# Altium schematic sheet Block Diagram.SchDoc: B100AA Development Kit Block Diagram
size A3
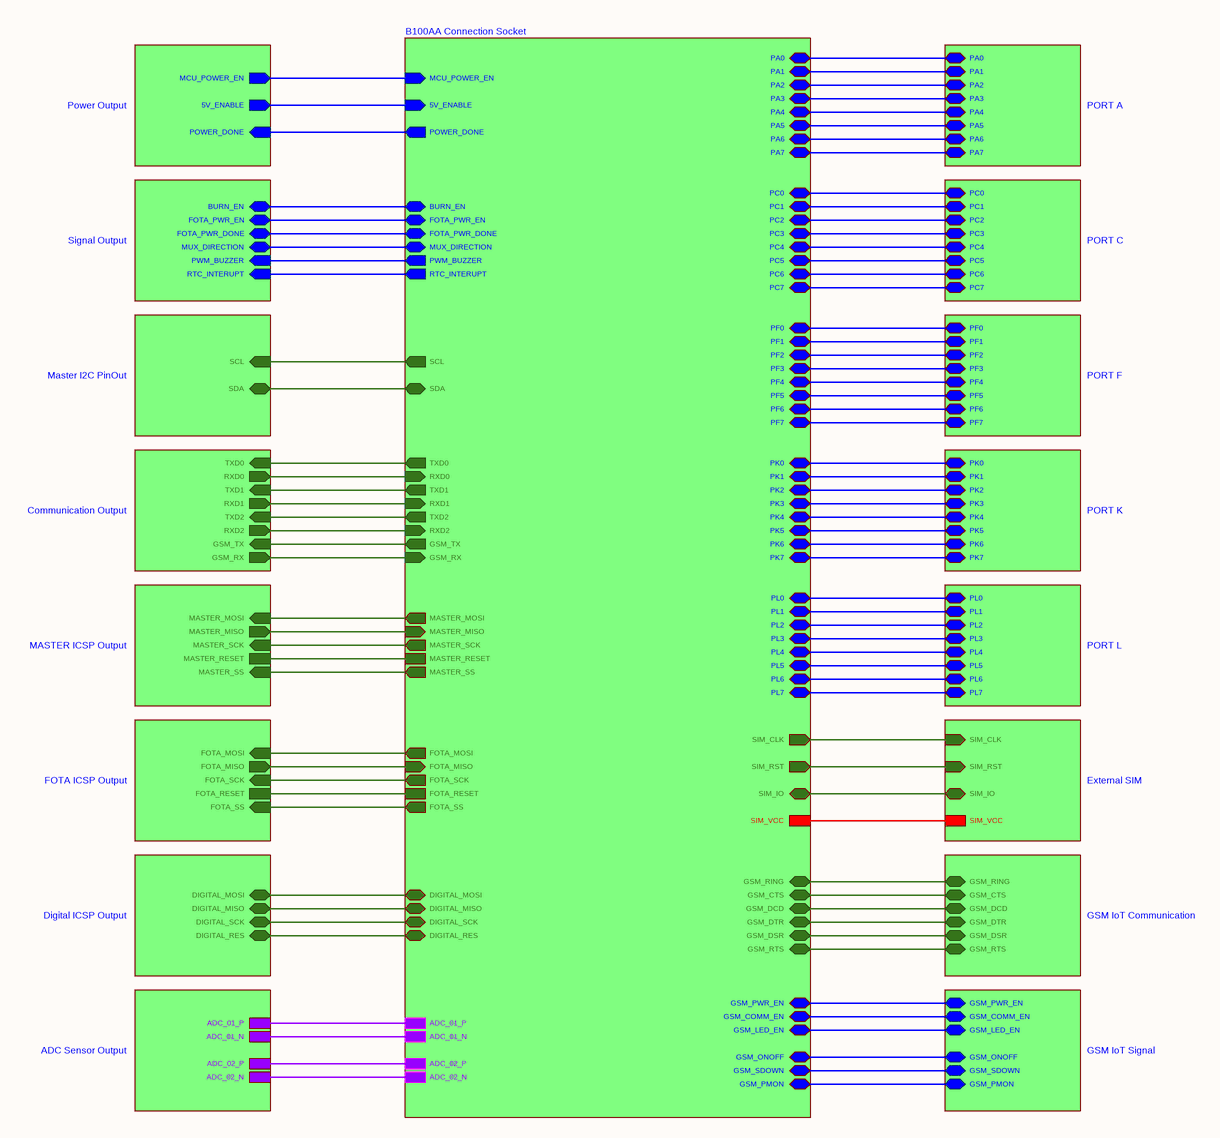
[diagram p0: Block Diagram.SchDoc]

## Sub-sheets
ADC Sensor Output = ADS Sensor Sockets.SchDoc: ADC_01_N, ADC_02_N, ADC_02_P, ADC_01_P
B100AA Connection Socket = Connection Socket.SchDoc: GSM_COMM_EN (bidir), PC6 (bidir), PF1 (bidir), PF3 (bidir), GSM_CTS (bidir), PF0 (bidir), GSM_TX (out), GSM_RX (in), PA6 (bidir), GSM_PMON (bidir), PK5 (bidir), PF2 (bidir), GSM_RING (bidir), ADC_01_P, PA5 (bidir), PL1 (bidir), PL2 (bidir), GSM_DCD (bidir), GSM_DTR (bidir), BURN_EN (bidir), PA4 (bidir), PA3 (bidir), PK0 (bidir), PC4 (bidir), GSM_DSR (bidir), ADC_02_P, GSM_LED_EN (bidir), ADC_02_N, PF7 (bidir), TXD1 (out), PK2 (bidir), SIM_CLK (out), DIGITAL_SCK (bidir), GSM_RTS (bidir), SIM_RST (out), PL4 (bidir), GSM_PWR_EN (bidir), GSM_ONOFF (bidir), PA1 (bidir), PK1 (bidir), PK4 (bidir), PF6 (bidir), PL5 (bidir), PF5 (bidir), SIM_IO (bidir), PK6 (bidir), FOTA_MISO (in), PK7 (bidir), SCL (out), ADC_01_N, SDA (bidir), PC3 (bidir), PC1 (bidir), PL7 (bidir), PC2 (bidir), PL6 (bidir), PK3 (bidir), DIGITAL_MOSI (bidir), PA2 (bidir), FOTA_PWR_DONE (bidir), FOTA_PWR_EN (bidir), PL3 (bidir), RXD2 (in), PWM_BUZZER (out), MUX_DIRECTION (bidir), SIM_VCC, 5V_ENABLE (in), PC7 (bidir), GSM_SDOWN (bidir), PA0 (bidir), RTC_INTERUPT (out), DIGITAL_MISO (bidir), PA7 (bidir), RXD1 (in), TXD2 (out), RXD0 (in), TXD0 (out), PC0 (bidir), PF4 (bidir), DIGITAL_RES (bidir), PL0 (bidir), MCU_POWER_EN (in), FOTA_MOSI (out), PC5 (bidir), POWER_DONE (out), FOTA_SS (out), FOTA_SCK (out), FOTA_RESET, MASTER_MISO (in), MASTER_RESET, MASTER_MOSI (out), MASTER_SCK (out), MASTER_SS (out)
Communication Output = UART Communication.SchDoc: TXD2 (in), RXD1 (out), RXD2 (out), GSM_RX (out), GSM_TX (in), TXD0 (in), TXD1 (in), RXD0 (out)
Digital ICSP Output = Digital ICSP Test Points.SchDoc: DIGITAL_SCK (bidir), DIGITAL_MISO (bidir), DIGITAL_RES (bidir), DIGITAL_MOSI (bidir)
External SIM = External SIM Tray.SchDoc: SIM_IO (bidir), SIM_VCC, SIM_CLK (in), SIM_RST (in)
FOTA ICSP Output = FOTA MCU ICSP Communication.SchDoc: FOTA_MISO (out), FOTA_MOSI (in), FOTA_RESET, FOTA_SCK (in), FOTA_SS (in)
GSM IoT Communication = GSM Communication Signals.SchDoc: GSM_DSR (bidir), GSM_RING (bidir), GSM_DCD (bidir), GSM_DTR (bidir), GSM_CTS (bidir), GSM_RTS (bidir)
GSM IoT Signal = GSM Control Signals.SchDoc: GSM_COMM_EN (bidir), GSM_LED_EN (bidir), GSM_SDOWN (bidir), GSM_PMON (bidir), GSM_ONOFF (bidir), GSM_PWR_EN (bidir)
Master I2C PinOut = I2C PinOut.SchDoc: SCL (in), SDA (bidir)
MASTER ICSP Output = Master MCU ICSP Communication.SchDoc: MASTER_MISO (out), MASTER_SCK (in), MASTER_MOSI (in), MASTER_SS (in), MASTER_RESET
PORT A = Digital Port A.SchDoc: PA7 (bidir), PA2 (bidir), PA5 (bidir), PA6 (bidir), PA1 (bidir), PA3 (bidir), PA4 (bidir), PA0 (bidir)
PORT C = Digital Port C.SchDoc: PC7 (bidir), PC2 (bidir), PC5 (bidir), PC6 (bidir), PC1 (bidir), PC3 (bidir), PC4 (bidir), PC0 (bidir)
PORT F = Digital Port F.SchDoc: PF7 (bidir), PF2 (bidir), PF5 (bidir), PF6 (bidir), PF1 (bidir), PF3 (bidir), PF4 (bidir), PF0 (bidir)
PORT K = Digital Port K.SchDoc: PK7 (bidir), PK2 (bidir), PK5 (bidir), PK6 (bidir), PK1 (bidir), PK3 (bidir), PK4 (bidir), PK0 (bidir)
PORT L = Digital Port L.SchDoc: PL7 (bidir), PL2 (bidir), PL5 (bidir), PL6 (bidir), PL1 (bidir), PL3 (bidir), PL4 (bidir), PL0 (bidir)
Power Output = Power Network.SchDoc: MCU_POWER_EN (out), POWER_DONE (in), 5V_ENABLE (out)
Signal Output = Signal Outputs.SchDoc: FOTA_PWR_DONE (bidir), MUX_DIRECTION (bidir), FOTA_PWR_EN (bidir), RTC_INTERUPT (in), BURN_EN (bidir), PWM_BUZZER (in)

## Nets
(unnamed): sheet B100AA Connection Socket/GSM_COMM_EN, sheet GSM IoT Signal/GSM_COMM_EN
(unnamed): sheet B100AA Connection Socket/PC6, sheet PORT C/PC6
(unnamed): sheet B100AA Connection Socket/PF1, sheet PORT F/PF1
(unnamed): sheet B100AA Connection Socket/PF3, sheet PORT F/PF3
(unnamed): sheet B100AA Connection Socket/GSM_CTS, sheet GSM IoT Communication/GSM_CTS
(unnamed): sheet B100AA Connection Socket/PF0, sheet PORT F/PF0
(unnamed): sheet B100AA Connection Socket/GSM_TX, sheet Communication Output/GSM_TX
(unnamed): sheet B100AA Connection Socket/GSM_RX, sheet Communication Output/GSM_RX
(unnamed): sheet B100AA Connection Socket/PA6, sheet PORT A/PA6
(unnamed): sheet B100AA Connection Socket/GSM_PMON, sheet GSM IoT Signal/GSM_PMON
(unnamed): sheet B100AA Connection Socket/PK5, sheet PORT K/PK5
(unnamed): sheet B100AA Connection Socket/PF2, sheet PORT F/PF2
(unnamed): sheet B100AA Connection Socket/GSM_RING, sheet GSM IoT Communication/GSM_RING
(unnamed): sheet B100AA Connection Socket/ADC_01_P, sheet ADC Sensor Output/ADC_01_P
(unnamed): sheet B100AA Connection Socket/PA5, sheet PORT A/PA5
(unnamed): sheet B100AA Connection Socket/PL1, sheet PORT L/PL1
(unnamed): sheet B100AA Connection Socket/PL2, sheet PORT L/PL2
(unnamed): sheet B100AA Connection Socket/GSM_DCD, sheet GSM IoT Communication/GSM_DCD
(unnamed): sheet B100AA Connection Socket/GSM_DTR, sheet GSM IoT Communication/GSM_DTR
(unnamed): sheet B100AA Connection Socket/BURN_EN, sheet Signal Output/BURN_EN
(unnamed): sheet B100AA Connection Socket/PA4, sheet PORT A/PA4
(unnamed): sheet B100AA Connection Socket/PA3, sheet PORT A/PA3
(unnamed): sheet B100AA Connection Socket/PK0, sheet PORT K/PK0
(unnamed): sheet B100AA Connection Socket/PC4, sheet PORT C/PC4
(unnamed): sheet B100AA Connection Socket/GSM_DSR, sheet GSM IoT Communication/GSM_DSR
(unnamed): sheet B100AA Connection Socket/ADC_02_P, sheet ADC Sensor Output/ADC_02_P
(unnamed): sheet B100AA Connection Socket/GSM_LED_EN, sheet GSM IoT Signal/GSM_LED_EN
(unnamed): sheet B100AA Connection Socket/ADC_02_N, sheet ADC Sensor Output/ADC_02_N
(unnamed): sheet B100AA Connection Socket/PF7, sheet PORT F/PF7
(unnamed): sheet B100AA Connection Socket/TXD1, sheet Communication Output/TXD1
(unnamed): sheet B100AA Connection Socket/PK2, sheet PORT K/PK2
(unnamed): sheet B100AA Connection Socket/SIM_CLK, sheet External SIM/SIM_CLK
(unnamed): sheet B100AA Connection Socket/DIGITAL_SCK, sheet Digital ICSP Output/DIGITAL_SCK
(unnamed): sheet B100AA Connection Socket/GSM_RTS, sheet GSM IoT Communication/GSM_RTS
(unnamed): sheet B100AA Connection Socket/SIM_RST, sheet External SIM/SIM_RST
(unnamed): sheet B100AA Connection Socket/PL4, sheet PORT L/PL4
(unnamed): sheet B100AA Connection Socket/GSM_PWR_EN, sheet GSM IoT Signal/GSM_PWR_EN
(unnamed): sheet B100AA Connection Socket/GSM_ONOFF, sheet GSM IoT Signal/GSM_ONOFF
(unnamed): sheet B100AA Connection Socket/PA1, sheet PORT A/PA1
(unnamed): sheet B100AA Connection Socket/PK1, sheet PORT K/PK1
(unnamed): sheet B100AA Connection Socket/PK4, sheet PORT K/PK4
(unnamed): sheet B100AA Connection Socket/PF6, sheet PORT F/PF6
(unnamed): sheet B100AA Connection Socket/PL5, sheet PORT L/PL5
(unnamed): sheet B100AA Connection Socket/PF5, sheet PORT F/PF5
(unnamed): sheet B100AA Connection Socket/SIM_IO, sheet External SIM/SIM_IO
(unnamed): sheet B100AA Connection Socket/PK6, sheet PORT K/PK6
(unnamed): sheet B100AA Connection Socket/FOTA_MISO, sheet FOTA ICSP Output/FOTA_MISO
(unnamed): sheet B100AA Connection Socket/PK7, sheet PORT K/PK7
(unnamed): sheet B100AA Connection Socket/SCL, sheet Master I2C PinOut/SCL
(unnamed): sheet B100AA Connection Socket/ADC_01_N, sheet ADC Sensor Output/ADC_01_N
(unnamed): sheet B100AA Connection Socket/SDA, sheet Master I2C PinOut/SDA
(unnamed): sheet B100AA Connection Socket/PC3, sheet PORT C/PC3
(unnamed): sheet B100AA Connection Socket/PC1, sheet PORT C/PC1
(unnamed): sheet B100AA Connection Socket/PL7, sheet PORT L/PL7
(unnamed): sheet B100AA Connection Socket/PC2, sheet PORT C/PC2
(unnamed): sheet B100AA Connection Socket/PL6, sheet PORT L/PL6
(unnamed): sheet B100AA Connection Socket/PK3, sheet PORT K/PK3
(unnamed): sheet B100AA Connection Socket/DIGITAL_MOSI, sheet Digital ICSP Output/DIGITAL_MOSI
(unnamed): sheet B100AA Connection Socket/PA2, sheet PORT A/PA2
(unnamed): sheet B100AA Connection Socket/FOTA_PWR_DONE, sheet Signal Output/FOTA_PWR_DONE
(unnamed): sheet B100AA Connection Socket/FOTA_PWR_EN, sheet Signal Output/FOTA_PWR_EN
(unnamed): sheet B100AA Connection Socket/PL3, sheet PORT L/PL3
(unnamed): sheet B100AA Connection Socket/RXD2, sheet Communication Output/RXD2
(unnamed): sheet B100AA Connection Socket/PWM_BUZZER, sheet Signal Output/PWM_BUZZER
(unnamed): sheet B100AA Connection Socket/MUX_DIRECTION, sheet Signal Output/MUX_DIRECTION
(unnamed): sheet B100AA Connection Socket/SIM_VCC, sheet External SIM/SIM_VCC
(unnamed): sheet B100AA Connection Socket/5V_ENABLE, sheet Power Output/5V_ENABLE
(unnamed): sheet B100AA Connection Socket/PC7, sheet PORT C/PC7
(unnamed): sheet B100AA Connection Socket/GSM_SDOWN, sheet GSM IoT Signal/GSM_SDOWN
(unnamed): sheet B100AA Connection Socket/PA0, sheet PORT A/PA0
(unnamed): sheet B100AA Connection Socket/RTC_INTERUPT, sheet Signal Output/RTC_INTERUPT
(unnamed): sheet B100AA Connection Socket/DIGITAL_MISO, sheet Digital ICSP Output/DIGITAL_MISO
(unnamed): sheet B100AA Connection Socket/PA7, sheet PORT A/PA7
(unnamed): sheet B100AA Connection Socket/RXD1, sheet Communication Output/RXD1
(unnamed): sheet B100AA Connection Socket/TXD2, sheet Communication Output/TXD2
(unnamed): sheet B100AA Connection Socket/RXD0, sheet Communication Output/RXD0
(unnamed): sheet B100AA Connection Socket/TXD0, sheet Communication Output/TXD0
(unnamed): sheet B100AA Connection Socket/PC0, sheet PORT C/PC0
(unnamed): sheet B100AA Connection Socket/PF4, sheet PORT F/PF4
(unnamed): sheet B100AA Connection Socket/DIGITAL_RES, sheet Digital ICSP Output/DIGITAL_RES
(unnamed): sheet B100AA Connection Socket/PL0, sheet PORT L/PL0
(unnamed): sheet B100AA Connection Socket/MCU_POWER_EN, sheet Power Output/MCU_POWER_EN
(unnamed): sheet B100AA Connection Socket/FOTA_MOSI, sheet FOTA ICSP Output/FOTA_MOSI
(unnamed): sheet B100AA Connection Socket/PC5, sheet PORT C/PC5
(unnamed): sheet B100AA Connection Socket/POWER_DONE, sheet Power Output/POWER_DONE
(unnamed): sheet B100AA Connection Socket/FOTA_SS, sheet FOTA ICSP Output/FOTA_SS
(unnamed): sheet B100AA Connection Socket/FOTA_SCK, sheet FOTA ICSP Output/FOTA_SCK
(unnamed): sheet B100AA Connection Socket/FOTA_RESET, sheet FOTA ICSP Output/FOTA_RESET
(unnamed): sheet B100AA Connection Socket/MASTER_MISO, sheet MASTER ICSP Output/MASTER_MISO
(unnamed): sheet B100AA Connection Socket/MASTER_RESET, sheet MASTER ICSP Output/MASTER_RESET
(unnamed): sheet B100AA Connection Socket/MASTER_MOSI, sheet MASTER ICSP Output/MASTER_MOSI
(unnamed): sheet B100AA Connection Socket/MASTER_SCK, sheet MASTER ICSP Output/MASTER_SCK
(unnamed): sheet B100AA Connection Socket/MASTER_SS, sheet MASTER ICSP Output/MASTER_SS

## Notes on the sheet
- Title
- Size:
- Date:
- A3
- Number:
- Time:
- Revision:
- Sheet
- of
- File: